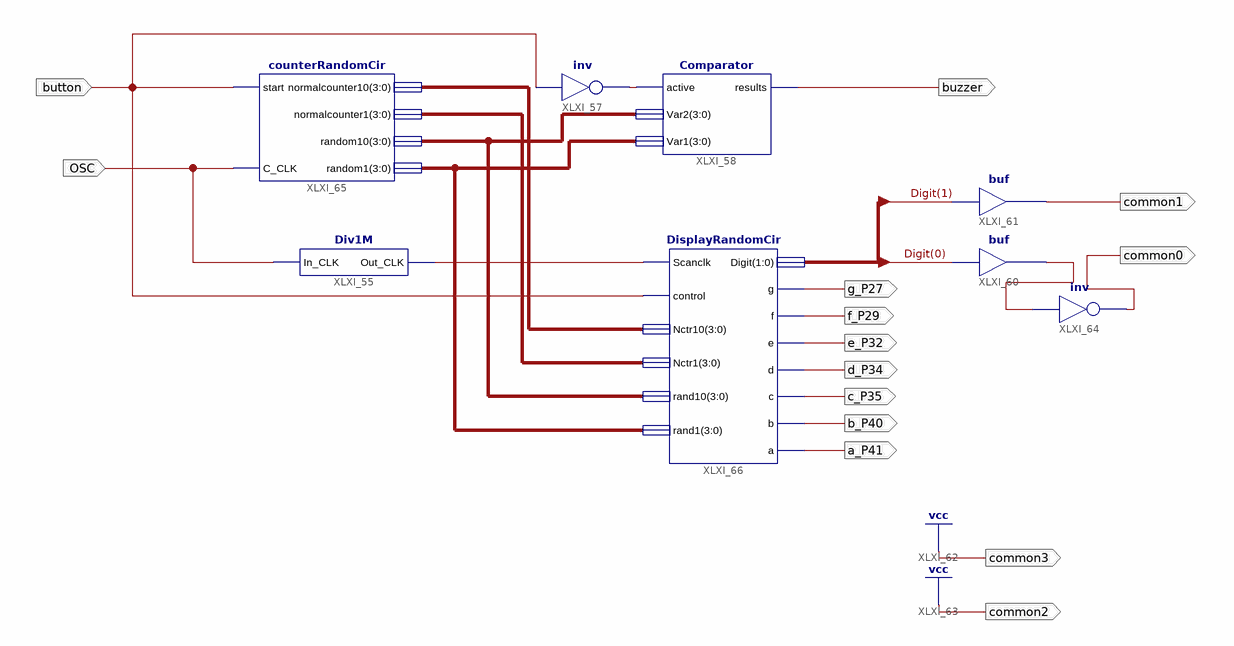
[diagram p0: schematic sheet 1]
// Xilinx ISE schematic LAB6.sch (spartan6) as structural Verilog: 8 symbols, 14 ports
module LAB6 (
  input  OSC,
  input  button,
  output buzzer,
  output common1,
  output common0,
  output g_P27,
  output f_P29,
  output e_P32,
  output d_P34,
  output c_P35,
  output b_P40,
  output a_P41,
  output common3,
  output common2
);

  wire XLXN_8, XLXN_22, XLXN_45;
  wire [1:0] Digit;
  wire [3:0] XLXN_28, XLXN_29, XLXN_31, XLXN_32;

  Div1M XLXI_55 (.In_CLK(OSC), .Out_CLK(XLXN_22));
  not XLXI_57 (XLXN_8, button);
  Comparator XLXI_58 (.active(XLXN_8), .Var2(XLXN_31), .Var1(XLXN_32), .results(buzzer));
  buf XLXI_60 (XLXN_45, Digit[0]);
  buf XLXI_61 (common1, Digit[1]);
  not XLXI_64 (common0, XLXN_45);
  counterRandomCir XLXI_65 (
    .start(button), .C_CLK(OSC), .normalcounter10(XLXN_28), .normalcounter1(XLXN_29), .random10(XLXN_31),
    .random1(XLXN_32));
  DisplayRandomCir XLXI_66 (
    .Scanclk(XLXN_22), .control(button), .Nctr10(XLXN_28), .Nctr1(XLXN_29), .rand10(XLXN_31),
    .rand1(XLXN_32), .Digit(Digit), .g(g_P27), .f(f_P29), .e(e_P32), .d(d_P34), .c(c_P35), .b(b_P40),
    .a(a_P41));

  assign common2 = 1'b1;
  assign common3 = 1'b1;
endmodule
